# Altium schematic sheet xbee reciever and main.SchDoc
size A2
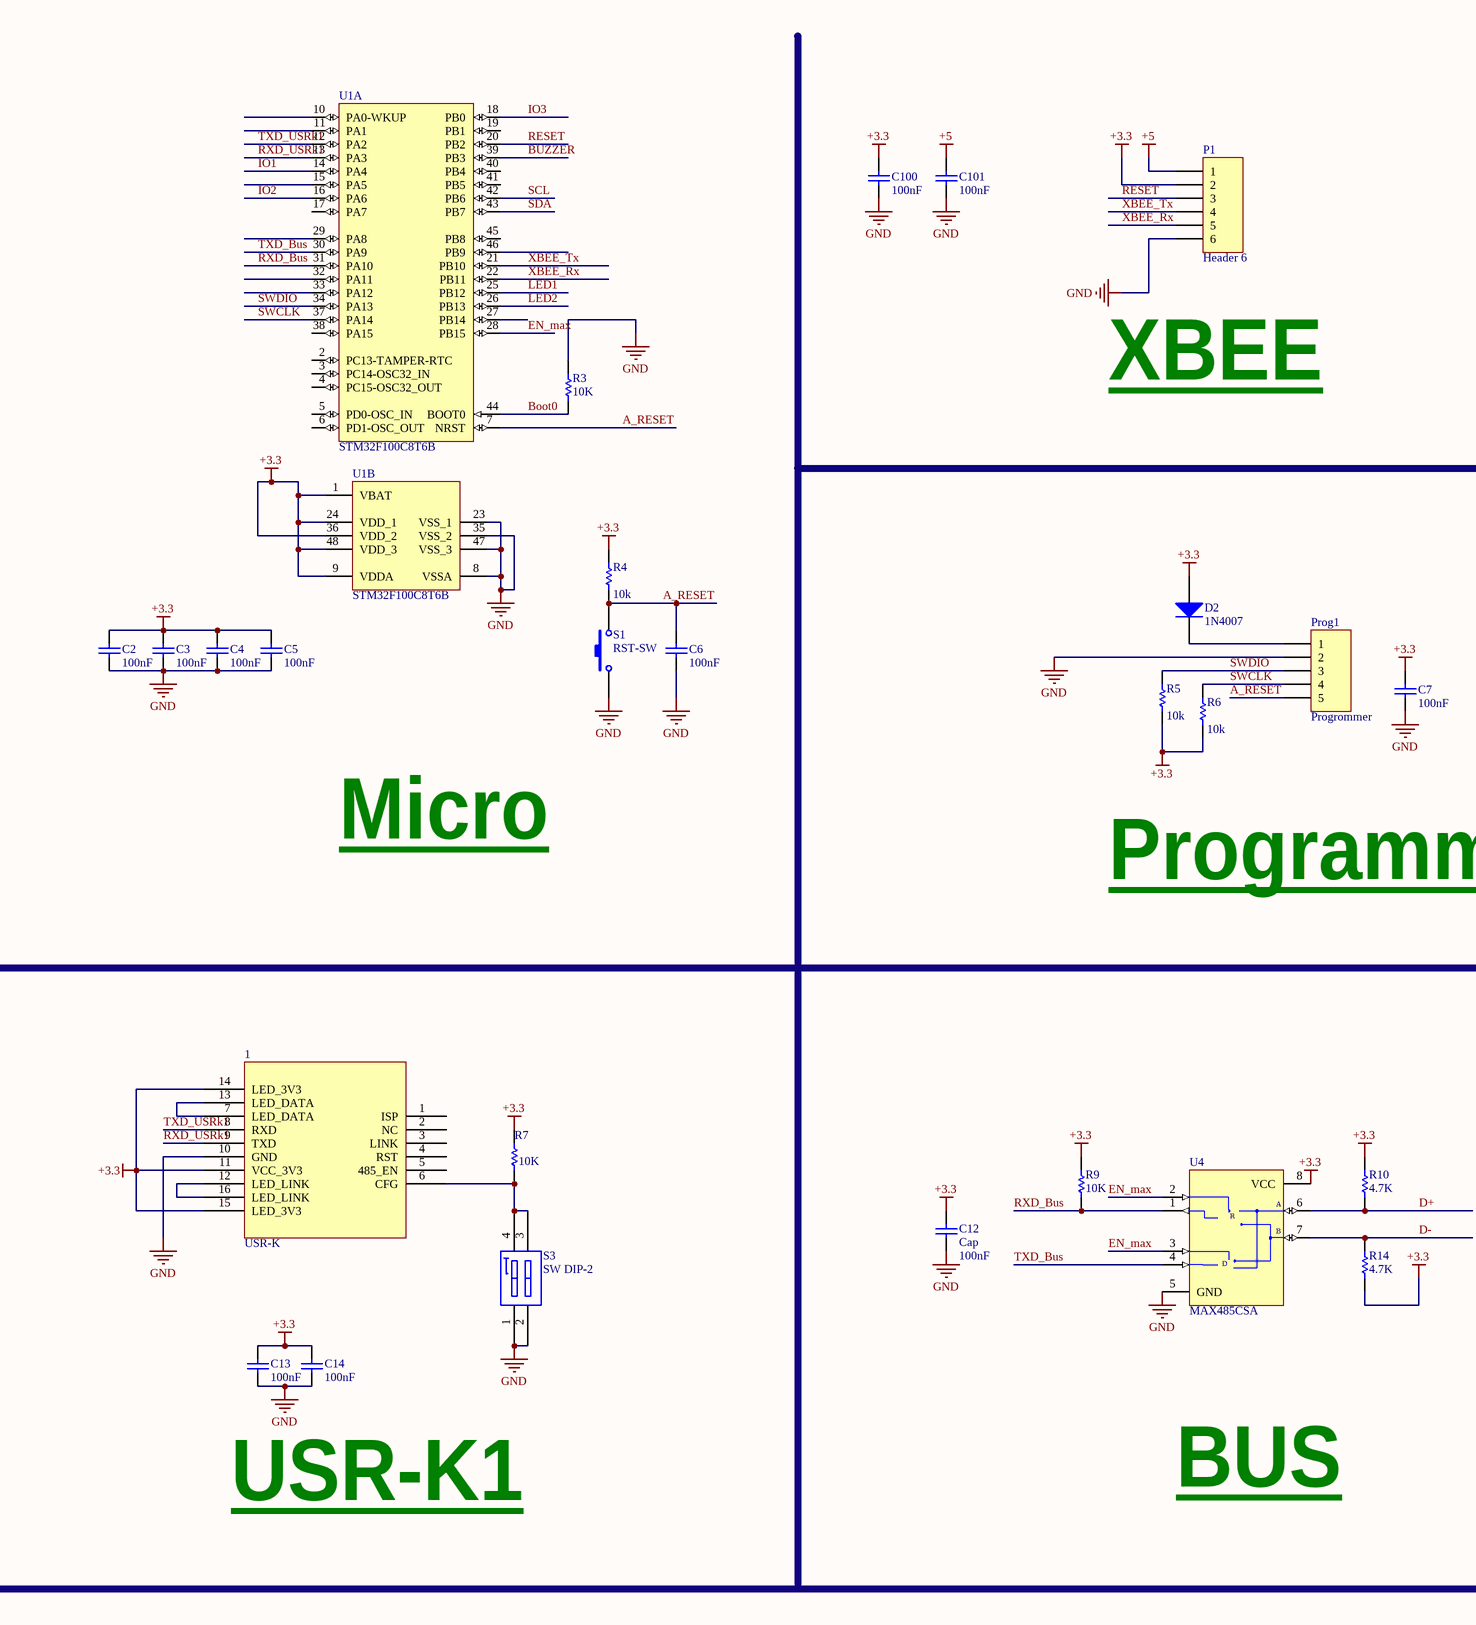
[diagram p0: xbee reciever and main.SchDoc, left]
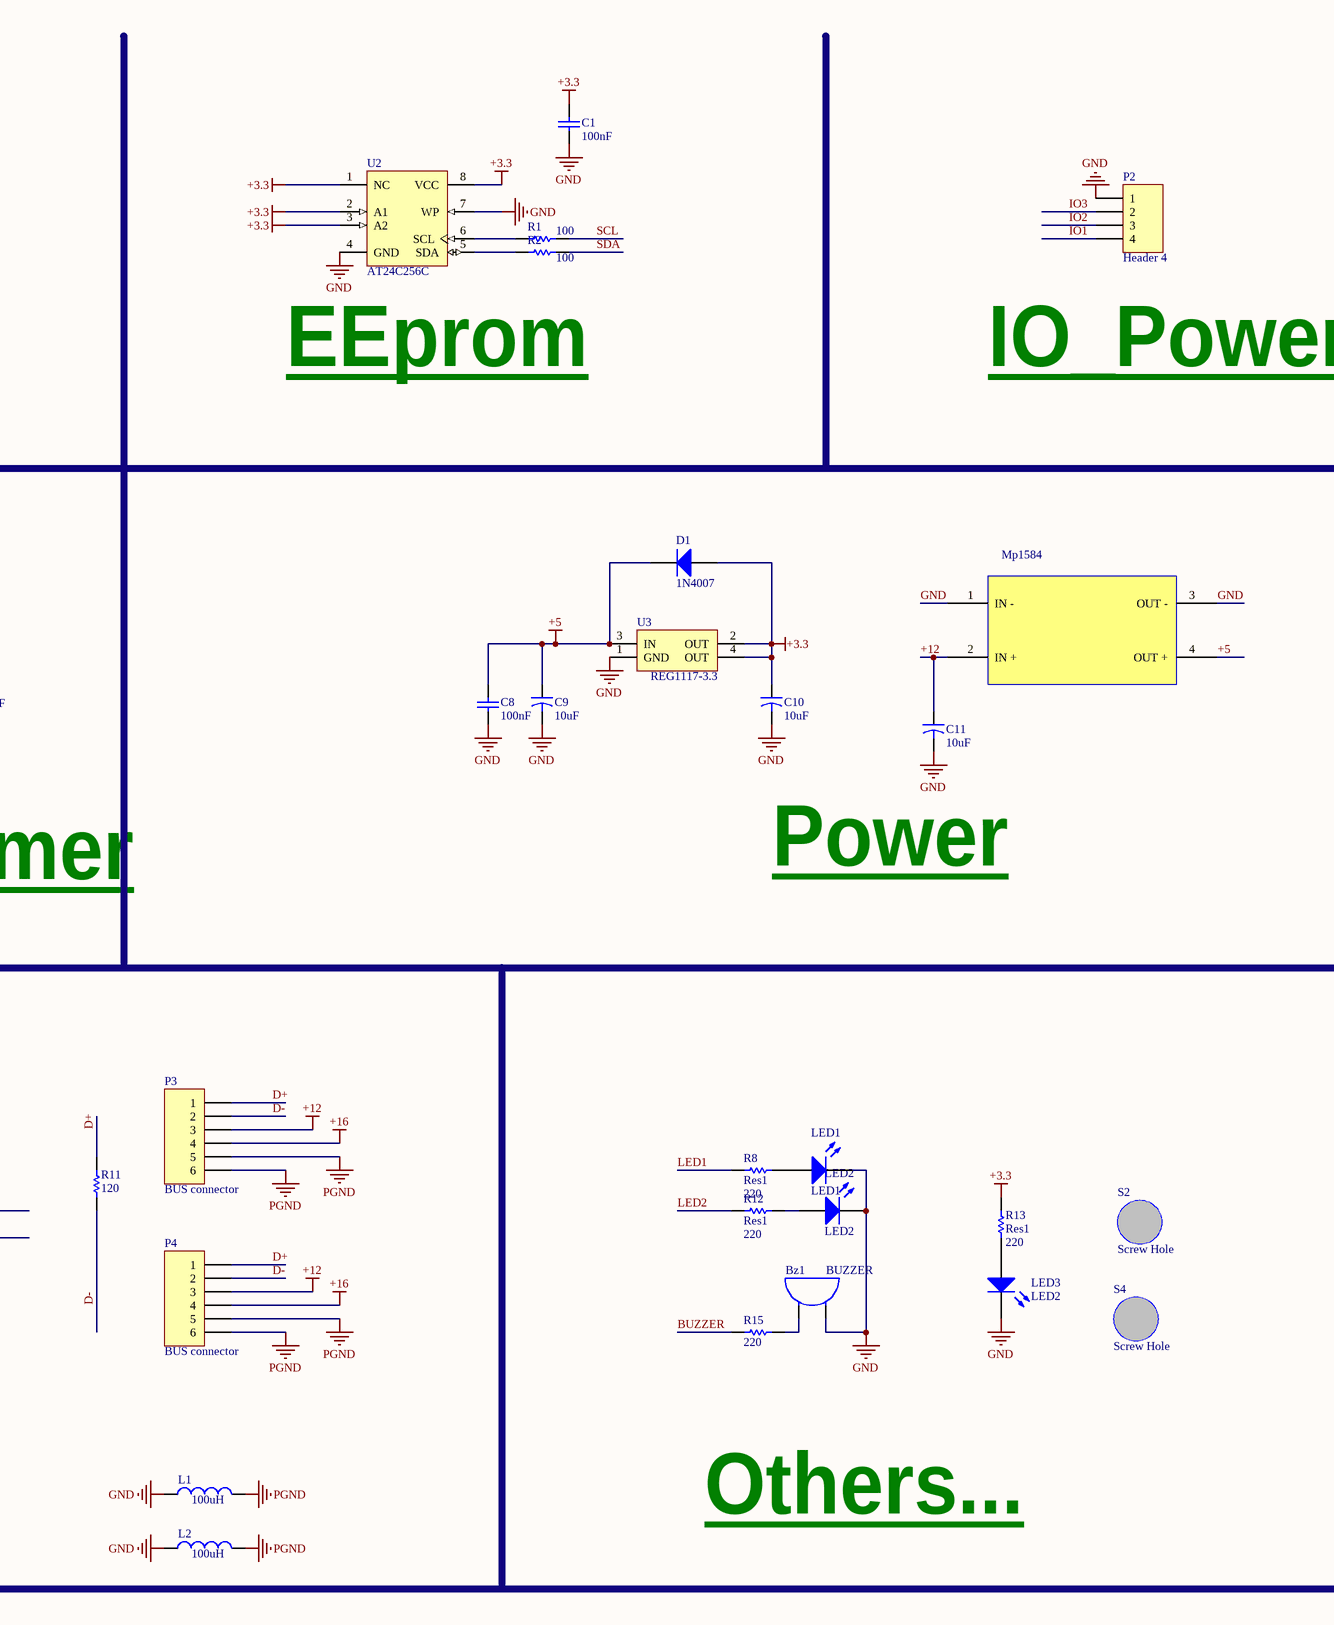
[diagram p1: xbee reciever and main.SchDoc, right]

## Parts
1  USR-K  [USR-K1]
Bz1  BUZZER  [BUZZER]
C1  value 100nF  [1608[0603]]
C2  value 100nF  [1608[0603]]
C3  value 100nF  [1608[0603]]
C4  value 100nF  [1608[0603]]
C5  value 100nF  [1608[0603]]
C6  value 100nF  [1608[0603]]
C7  value 100nF  [j1-0603]
C8  100nF  [J1-0603]
C9  value 10uF  [2012[0805]]  (hidden comment: Cap_El)
C10  value 10uF  [2012[0805]]  (hidden comment: Cap_El)
C11  value 10uF  [2012[0805]]  (hidden comment: Cap_El)
C12  Cap  value 100nF  [j1-0603]
C13  100nF  [J1-0603]
C14  100nF  [J1-0603]
C100  value 100nF  [1608[0603]]
C101  value 100nF  [1608[0603]]
D1  1N4007  [US1M]
D2  1N4007  [US1M]
L1  value 100uH  [2012[0805]]
L2  value 100uH  [2012[0805]]
LED1  LED1  [3518]
LED2  LED2  [3518]
LED3  LED2  [3518]
Mp1  Mp1584  [mp1584-1.8]
P1  Header 6  [HDR1X6]
P2  Header 4  [JP circular 4]
P3  BUS connector  [CON6-TIWAN]
P4  BUS connector  [con6-tiwan]
Prog1  Progrommer  [HDR1x5]
R1  value 100  [j1-0603]  (hidden comment: Res1)
R2  value 100  [j1-0603]  (hidden comment: Res1)
R3  10K  [J1-0603]
R4  value 10k  [J1-0603]
R5  value 10k  [J1-0603]
R6  value 10k  [J1-0603]
R7  10K  [J1-0603]
R8  Res1  value 220  [j1-0603]
R9  value 10K  [j1-0603]  (hidden comment: Res1)
R10  value 4.7K  [j1-0603]  (hidden comment: Res1)
R11  value 120  [j1-0603]  (hidden comment: Res1)
R12  Res1  value 220  [j1-0603]
R13  Res1  value 220  [j1-0603]
R14  value 4.7K  [j1-0603]  (hidden comment: Res1)
R15  220  [j1-0603]
S1  RST-SW  [SW-PB-4P]
S2  Screw Hole  [Screw Holw 3-6 mm]
S3  SW DIP-2  [SMD-4]
S4  Screw Hole  [Screw Holw 3-6 mm]
U1  STM32F100C8T6B  [STM-LQFP48_L]  (parts A,B of 2)
U2  AT24C256C  [8S1_N]
U3  REG1117-3.3  [SOT223]
U4  MAX485CSA  [NSO8_N]

## Nets
+3.3: 1.11(VCC_3V3) 1.14(LED_3V3) 1.15(LED_3V3) C1.2 C2.2 C3.2 C4.2 C5.2 C7.2 C10.1 C12.2 C13.2 C14.2 C100.2 D1.1(A) D2.1(A) P1.2 R4.1 R5.2 R6.2 R7.2 R9.1 R10.1 R13.1 R14.2 U1.1(VBAT) U1.9(VDDA) U1.24(VDD_1) U1.36(VDD_2) U1.48(VDD_3) U2.1(NC) U2.2(A1) U2.3(A2) U2.8(VCC) U3.2(OUT) U3.4(OUT) U4.8(VCC)
+5: C8.2 C9.1 C101.2 D1.2(K) Mp1.4(OUT_+) P1.1 U3.3(IN)
+12: C11.1 Mp1.2(IN_+) P3.3 P4.3
+16: P3.4 P4.4
GND: 1.10(GND) Bz1.2 C1.1 C2.1 C3.1 C4.1 C5.1 C6.1 C7.1 C8.1 C9.2 C10.2 C11.2 C12.1 C13.1 C14.1 C100.1 C101.1 L1.1 L2.1 LED1.2(K) LED2.2(K) LED3.2(K) Mp1.1(IN_-) Mp1.3(OUT_-) P1.6 P2.1 Prog1.2 R3.1 S1.1 S3.1(A1) S3.2(A2) U1.8(VSSA) U1.23(VSS_1) U1.35(VSS_2) U1.47(VSS_3) U2.4(GND) U2.7(WP) U3.1(GND) U4.5(GND)
PGND: L1.2 L2.2 P3.5 P3.6 P4.5 P4.6
A_RESET: C6.2 Prog1.5 R4.2 S1.2 U1.7(NRST)
Boot0: R3.2 U1.44(BOOT0)
BUZZER: R15.1 U1.39(PB3)
D+: P3.1 P4.1 R10.2 R11.1 U4.6(A)
D-: P3.2 P4.2 R11.2 R14.1 U4.7(B)
EN_max: U1.28(PB15) U4.2(~{RE}) U4.3(DE)
IO1: P2.4 U1.14(PA4)
IO2: P2.3 U1.16(PA6)
IO3: P2.2 U1.18(PB0)
LED1: R8.1 U1.25(PB12)
LED2: R12.1 U1.26(PB13)
RESET: P1.3 U1.20(PB2)
RXD_Bus: R9.2 U1.31(PA10) U4.1(RO)
RXD_USRk1: 1.9(TXD) U1.13(PA3)
SCL: R1.2 U1.42(PB6)
SDA: R2.2 U1.43(PB7)
SWCLK: Prog1.4 R6.1 U1.37(PA14)
SWDIO: Prog1.3 R5.1 U1.34(PA13)
TXD_Bus: U1.30(PA9) U4.4(DI)
TXD_USRk1: 1.8(RXD) U1.12(PA2)
XBEE_Rx: P1.5 U1.22(PB11)
XBEE_Tx: P1.4 U1.21(PB10)
Net1_6: 1.6(CFG) R7.1 S3.3(B2) S3.4(B1)
Net1_7: 1.7(LED_DATA) 1.13(LED_DATA)
Net1_12: 1.12(LED_LINK) 1.16(LED_LINK)
NetBz1_1: Bz1.1 R15.2
NetD2_2: D2.2(K) Prog1.1
NetLED1_1: LED1.1(A) R8.2
NetLED2_1: LED2.1(A) R12.2
NetLED3_1: LED3.1(A) R13.2
NetR1_1: R1.1 U2.6(SCL)
NetR2_1: R2.1 U2.5(SDA)

Not connected (* = marked no-connect by the designer): 1 1(ISP) 2(NC) 3(LINK) 4(RST) 5(485_EN); U1 2(PC13-TAMPER-RTC) 3(PC14-OSC32_IN) 4(PC15-OSC32_OUT) 5(PD0-OSC_IN) 6(PD1-OSC_OUT) 10(PA0-WKUP) 11(PA1) 15(PA5) 17(PA7) 19(PB1) 27(PB14) 29(PA8) 32(PA11) 33(PA12) 38(PA15) 40(PB4) 41(PB5) 45(PB8) 46(PB9)

## Notes on the sheet
- XBEE
- EEprom
- (near P2) IO_Power
- Micro
- Programmer
- Power
- USR-K1
- BUS
- Others...
- (in symbol MAX485CSA) R; D

## Library data of the parts
C1-C7 C100 C101 = Cap: Capacitor; Manufacturer: Generic Components; Class: Passive; Published: 08/06/2000; Publisher: Altium Hobart Technology Centre; SubClass: Capacitor
C8 C12-C14 = Cap: Capacitor; Published: 8-Jun-2000; LatestRevisionDate: 17-Jul-2002; LatestRevisionNote: Re-released for DXP Platform.; PackageReference: RAD-0.3; Publisher: Altium Limited
  C8 C13 C14: Value: 100nF
C9-C11 = Cap_El: Capacitor; Published: 23-Sep-2002; PackageReference: CAPR5-4X5; Publisher: Altium Limited
D1 D2 = Diode: 1 Amp General Purpose Rectifier; Revision 1: 11-Jul-2000: SIM Model Added.; Revision 2: 17-Jul-2002: Re-released for DXP Platform.; Package Information: Latest Revision: Aug-1999; Code - JEDEC: DO-204-AL; Published: 8-Jun-2000; Datasheet: Latest Revision: 1998; Package Reference: DO-41; Publisher: Altium Limited
L1 L2 = Inductor: Manufacturer: Generic Components; Class: Passive; Published: 08/06/2000; Publisher: Altium Hobart Technology Centre; SubClass: Inductor
LED1-LED3 = LED3: Typical BLUE SiC LED; pin to pad: 1>2 2>1; Published: 8-Jun-2000; LatestRevisionDate: 17-Dec-2003; LatestRevisionNote: PCB Footprint replaced.; DatasheetDocument: 16-Apr-2002; PackageDocument: 16-Apr-2002; PackageReference: 3.5X2.8X1.9; Publisher: Altium Limited
P1 P3 P4 = Header 6: Header, 6-Pin; LatestRevisionDate: 17-Jul-2002; LatestRevisionNote: Re-released for DXP Platform.; Publisher: Altium Limited
P2 = Header 4: Header, 4-Pin; LatestRevisionDate: 17-Jul-2002; LatestRevisionNote: Re-released for DXP Platform.; Publisher: Altium Limited
Prog1 = Header 5: Header, 5-Pin; LatestRevisionDate: 17-Jul-2002; LatestRevisionNote: Re-released for DXP Platform.; Publisher: Altium Limited
R1 R2 R8-R14 = Res1: Resistor; Published: 8-Jun-2000; LatestRevisionDate: 17-Jul-2002; LatestRevisionNote: Re-released for DXP Platform.; PackageReference: AXIAL-0.3; Publisher: Altium Limited
R3 R7 R15 = Res1: Resistor; Value: 1K; Published: 8-Jun-2000; LatestRevisionDate: 17-Jul-2002; LatestRevisionNote: Re-released for DXP Platform.; PackageReference: AXIAL-0.3; Publisher: Altium Limited
R4-R6 = Res: Semiconductor Resistor; Published: 8-Jun-2000; LatestRevisionDate: 17-Jul-2002; LatestRevisionNote: Re-released for DXP Platform.; PackageReference: AXIAL-0.5; Publisher: Altium Limited
S1 = SW-PB: Switch; Published: 24-Mar-1999; LatestRevisionDate: 17-Jul-2002; LatestRevisionNote: Re-released for DXP Platform.; PackageReference: SPST-2; Publisher: Altium Limited
U1 = STM32F100C8T6B: ARM Cortex-M3 32-bit MCU, 64 KB Flash, 8 KB Internal RAM, 37 I/Os, 48-pin LQFP, -40 to 85 degC, Tray; A/D Converter: 1x12-bit (10 Channel); D/A Converter: 2x12-bit (2 Channel); FLASH Size (Prog) (kB): 64; I/Os (High Current): 37; Internal RAM Size (kB): 8; Operating Frequency(F) (Processor speed) (MHz): 24; Supply Voltage(Vcc) min (V): 2; DatasheetVersion: Rev. 7; PackageVersion: Rev. 6, 06/2013; PackageReference: LQFP48; PackageDescription: 48-Pin Low Profile Quad Flat Package, 7 x 7 mm Body, 0.5 mm Pitch; Supplier 1: Digi-Key; Supplier Part Number 1: 497-10499-ND; Supplier 2: Farnell; Supplier Part Number 2: 1838511; Supplier 3: Newark; Supplier Part Number 3: 76R0988; Supplier 4: Mouser; Supplier Part Number 4: 511-STM32F100C8T6B; Core: ARM Cortex-M3; Packing: Tray; Mounting Technology: Surface Mount; PartNumber: STM32F100C8T6B; ComponentLink1Description: Manufacturer URL; ComponentLink1URL: http://www.st.com/web/en/home.html; ComponentLink2Description: Datasheet; ComponentLink2URL: http://www.st.com/st-web-ui/static/active/en/resource/technical/document/datasheet/CD00251732.pdf; ComponentLink3Description: Package Specification; ComponentLink3URL: http://www.st.com/st-web-ui/static/active/en/resource/technical/document/datasheet/DM00058181.pdf
U2 = AT24C04BN-SP25-B: 4Kbit (512 x 8), 2-wire Bus Automotive Serial EEPROM with Write Protect, 2.5V, 8-Pin SOIC, Bulk; Published: 20-Sep-2010; DatasheetVersion: 8517C,  Jan-2009; PackageVersion: revC, Mar-2005; PackageReference: 8S1; Publisher: Altium Limited; PackageDescription: 8-Lead (0.150" Wide Body), Plastic Gull Wing Small Outline (JEDEC SOIC); Code_JEDEC: MS-012-AA; Code_IPC: SOIC127P600-8; ComponentLink1Description: Manufacturer Link; ComponentLink1URL: http://www.atmel.com/products/serial/default.asp; ComponentLink2Description: Datasheet; ComponentLink2URL: http://www.atmel.com/dyn/resources/prod_documents/doc8517.pdf; ComponentLink3Description: Atmel.com Home; ComponentLink3URL: http://www.atmel.com
U3 = REG1117-3.3: 800mA and 1A Low Dropout Positive Regulator 2.85V, 3.3V, 5V, and Adjustable; Published: 8-Jun-2000; LatestRevisionDate: 17-Jul-2002; LatestRevisionNote: Re-released for DXP Platform.; DatasheetVersion: Sep-1997; PackageVersion: revC; PackageReference: ZZ311; Publisher: Altium Limited; PackageDescription: SOT-223/SC-73; 4 Leads; Body 6.7 x 7.3 mm, inc. leads (LxW max); ComponentLink1Description: Manufacturer Link; ComponentLink1URL: http://www.ti.com/; ComponentLink2Description: Datasheet; ComponentLink2URL: http://www-s.ti.com/sc/ds/REG1117.pdf
U4 = MAX485CSA: Low-Power, Slew-Rate-Limited RS-485/RS-422 Transceiver; Published: 16-Jan-2001; LatestRevisionDate: 13-Apr-2006; LatestRevisionNote: IPC-7351 Footprint Added.; DatasheetVersion: Feb-1996; PackageReference: NSO8; Publisher: Altium Limited; PackageDescription: 8-Pin Small Outline Integrated Circuit 1.27 mm Pitch; Code_JEDEC: MS-012-AA; Code_IPC: SOIC127P600-8; ComponentLink1Description: Manufacturer Link; ComponentLink1URL: http://www.maxim-ic.com/; ComponentLink2Description: Datasheet; ComponentLink2URL: http://pdfserv.maxim-ic.com/en/ds/MAX1487-MAX491.pdf